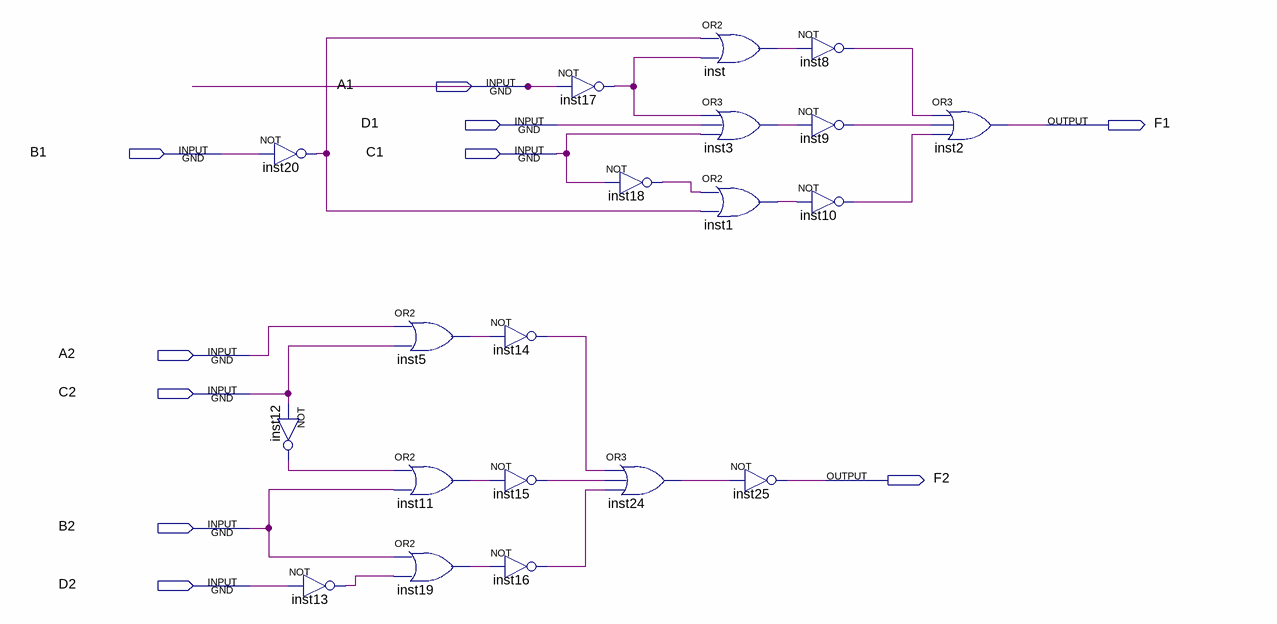
[diagram p0: schematic sheet]
// Quartus schematic tiv1_3.bdf as structural Verilog: 20 symbols, 10 pins
module tiv1_3 (
  input  A1,
  input  D1,
  input  B1,
  input  C1,
  input  A2,
  input  C2,
  input  B2,
  input  D2,
  output F1,
  output F2
);

  wire inst1_out, inst3_out, inst5_out, inst8_out, inst9_out, inst10_out, inst11_out, inst12_out, inst13_out,
       inst14_out, inst15_out, inst16_out, inst17_out, inst18_out, inst19_out, inst20_out, inst24_out,
       inst_out;

  not inst20 (inst20_out, B1);
  not inst12 (inst12_out, C2);
  not inst13 (inst13_out, D2);
  or inst5 (inst5_out, A2, C2);
  or inst11 (inst11_out, inst12_out, B2);
  or inst19 (inst19_out, B2, inst13_out);
  not inst14 (inst14_out, inst5_out);
  not inst15 (inst15_out, inst11_out);
  not inst16 (inst16_out, inst19_out);
  not inst17 (inst17_out, A1);
  not inst18 (inst18_out, C1);
  or inst24 (inst24_out, inst14_out, inst15_out, inst16_out);
  or inst (inst_out, inst20_out, inst17_out);
  or inst3 (inst3_out, inst17_out, D1, C1);
  or inst1 (inst1_out, inst18_out, inst20_out);
  not inst25 (F2, inst24_out);
  not inst8 (inst8_out, inst_out);
  not inst9 (inst9_out, inst3_out);
  not inst10 (inst10_out, inst1_out);
  or inst2 (F1, inst8_out, inst9_out, inst10_out);
endmodule
